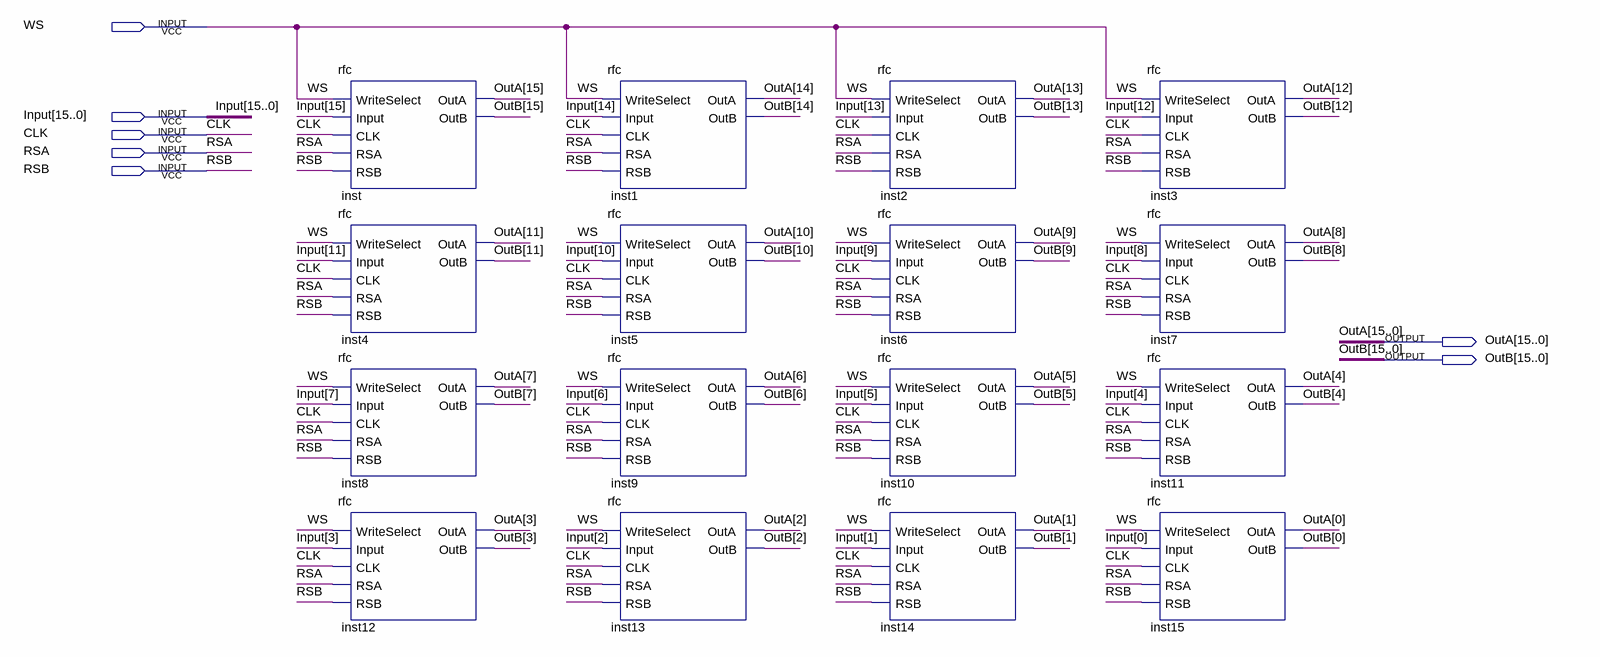
[diagram p0: schematic sheet]
// Quartus schematic rfc16.bdf as structural Verilog: 16 symbols, 7 pins
module rfc16 (
  input  WS,
  input  [15:0] Input,
  input  CLK,
  input  RSA,
  input  RSB,
  output [15:0] OutA,
  output [15:0] OutB
);

  rfc inst (.WriteSelect(WS), .Input(Input[15]), .CLK(CLK), .RSA(RSA), .RSB(RSB), .OutA(OutA[15]), .OutB(OutB[15]));
  rfc inst4 (.WriteSelect(WS), .Input(Input[11]), .CLK(CLK), .RSA(RSA), .RSB(RSB), .OutA(OutA[11]), .OutB(OutB[11]));
  rfc inst8 (.WriteSelect(WS), .Input(Input[7]), .CLK(CLK), .RSA(RSA), .RSB(RSB), .OutA(OutA[7]), .OutB(OutB[7]));
  rfc inst12 (.WriteSelect(WS), .Input(Input[3]), .CLK(CLK), .RSA(RSA), .RSB(RSB), .OutA(OutA[3]), .OutB(OutB[3]));
  rfc inst1 (.WriteSelect(WS), .Input(Input[14]), .CLK(CLK), .RSA(RSA), .RSB(RSB), .OutA(OutA[14]), .OutB(OutB[14]));
  rfc inst5 (.WriteSelect(WS), .Input(Input[10]), .CLK(CLK), .RSA(RSA), .RSB(RSB), .OutA(OutA[10]), .OutB(OutB[10]));
  rfc inst9 (.WriteSelect(WS), .Input(Input[6]), .CLK(CLK), .RSA(RSA), .RSB(RSB), .OutA(OutA[6]), .OutB(OutB[6]));
  rfc inst13 (.WriteSelect(WS), .Input(Input[2]), .CLK(CLK), .RSA(RSA), .RSB(RSB), .OutA(OutA[2]), .OutB(OutB[2]));
  rfc inst2 (.WriteSelect(WS), .Input(Input[13]), .CLK(CLK), .RSA(RSA), .RSB(RSB), .OutA(OutA[13]), .OutB(OutB[13]));
  rfc inst6 (.WriteSelect(WS), .Input(Input[9]), .CLK(CLK), .RSA(RSA), .RSB(RSB), .OutA(OutA[9]), .OutB(OutB[9]));
  rfc inst10 (.WriteSelect(WS), .Input(Input[5]), .CLK(CLK), .RSA(RSA), .RSB(RSB), .OutA(OutA[5]), .OutB(OutB[5]));
  rfc inst14 (.WriteSelect(WS), .Input(Input[1]), .CLK(CLK), .RSA(RSA), .RSB(RSB), .OutA(OutA[1]), .OutB(OutB[1]));
  rfc inst3 (.WriteSelect(WS), .Input(Input[12]), .CLK(CLK), .RSA(RSA), .RSB(RSB), .OutA(OutA[12]), .OutB(OutB[12]));
  rfc inst7 (.WriteSelect(WS), .Input(Input[8]), .CLK(CLK), .RSA(RSA), .RSB(RSB), .OutA(OutA[8]), .OutB(OutB[8]));
  rfc inst11 (.WriteSelect(WS), .Input(Input[4]), .CLK(CLK), .RSA(RSA), .RSB(RSB), .OutA(OutA[4]), .OutB(OutB[4]));
  rfc inst15 (.WriteSelect(WS), .Input(Input[0]), .CLK(CLK), .RSA(RSA), .RSB(RSB), .OutA(OutA[0]), .OutB(OutB[0]));
endmodule
